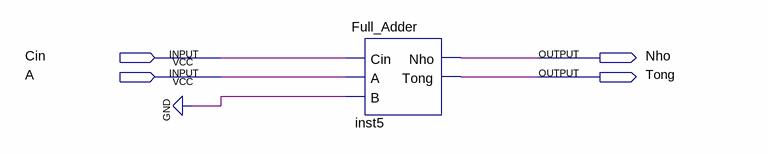
[diagram p0: schematic sheet]
// Quartus schematic INCREMENT-A.bdf as structural Verilog: 1 symbols, 4 pins
module \INCREMENT-A  (
  input  Cin,
  input  A,
  output Nho,
  output Tong
);

  Full_Adder inst5 (.Cin(Cin), .A(A), .B(1'b0), .Nho(Nho), .Tong(Tong));
endmodule
